# EAGLE design usb-led (EAGLE 6.6.0)
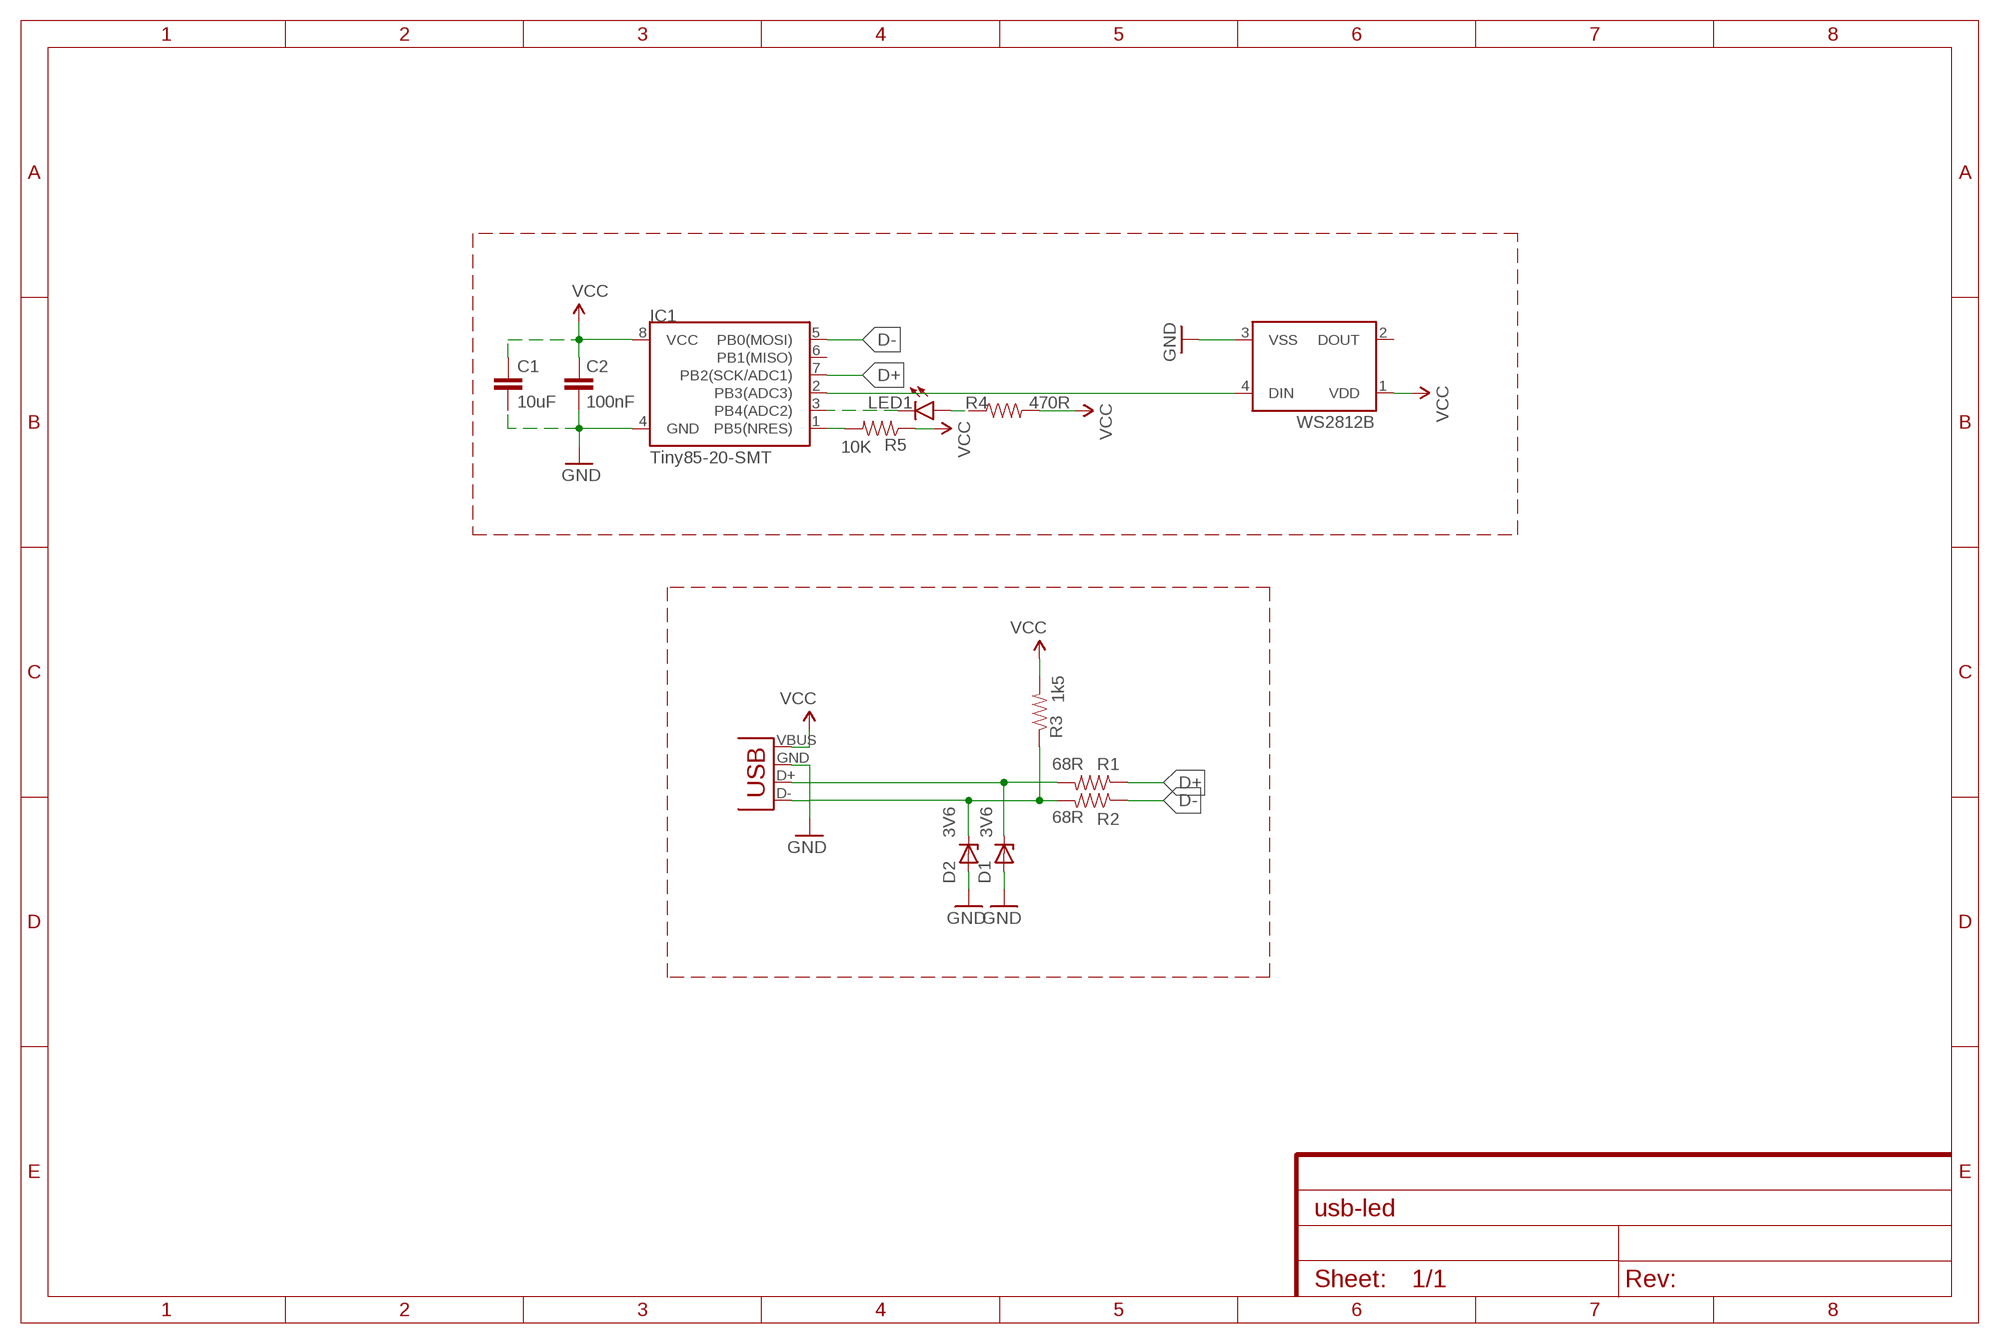
[diagram p0: schematic, sheet 1]

## Parts
C1  10uF  C-EUC0805  [C0805]
C2  100nF  CAP0805  [0805]
D1  3V6  ZD0603  [ZD0603]
D2  3V6  ZD0603  [ZD0603]
IC1  Tiny85-20-SMT  ATTINY45TINY85-20-SMT  [SO08-EIAJ]
LED1  LED0603  [LED-0603]
R1  68R  RESISTOR0603  [0603-RES]
R2  68R  RESISTOR0603  [0603-RES]
R3  1k5  RESISTOR0603  [0603-RES]
R4  470R  RESISTOR0603  [0603-RES]
R5  10K  RESISTOR0603-RES  [0603-RES]
USB  USB-A-H  [USB-A-H]
WS2812B  WS2812B  [WS2812B]

## Nets
C10: IC1.1(PB5(NRES)) R5.2
D+: IC1.7(PB2(SCK/ADC1)) R1.1
D-: IC1.5(PB0(MOSI)) R2.1
DIN: IC1.2(PB3(ADC3)) WS2812B.4(DIN)
EXT_D+: D1.K(C) R1.2 USB.D+(D-)
EXT_D-: D2.K(C) R2.2 R3.1 USB.D-(D+)
GND: C1.2 C2.2 D1.A D2.A IC1.4(GND) USB.GND(VBUS) WS2812B.3(VSS)
N$3: IC1.3(PB4(ADC2)) LED1.C
N$4: LED1.A R4.1
VCC: C1.1 C2.1 IC1.8(VCC) R3.2 R4.2 R5.1 USB.VBUS(GND) WS2812B.1(VDD)
Unconnected: IC1.6(PB1(MISO)) WS2812B.2(DOUT)

## Library data of the parts
C1 = rcl:C-EU: CAPACITOR, European symbol
C2 = SparkFun-Passives:CAP: Capacitor Standard 0603 ceramic capacitor, and 0.1" leaded capacitor.
D1 D2 = z-diode-0603:ZD0603: Z DIODE
IC1 = SparkFun-DigitalIC:ATTINY45: Atmel 8-pin 2/4/8kB flash uC; PROD_ID: IC-09092
LED1 = SparkFun-LED:LED: LEDs Standard schematic elements and footprints for 5mm, 3mm, 1206, and 0603 sized LEDs. 5mm - Spark Fun Electronics SKU : COM-00529 (and others)
R1-R5 = SparkFun-Resistors:RESISTOR: Resistor Basic schematic elements and footprints for 0603, 1206, and PTH resistors.
USB = SparkFun-Connectors:USB: USB Connectors USB-B-PTH is fully proven SKU : PRT-00139/CONN-08278 USB-miniB is fully proven SKU : PRT-00587 USB-A-PCB is untested. USB-A-H is throughly reviewed, but untested. Spark Fun Electronics SKU : PRT-00437 USB-B-SMT is throughly reviewed, but untested. Needs silkscreen touching up. USB-A-S has not been used/tested USB-MB-H has not been used/tested USB-MICROB has been used. CONN-09505
WS2812B = SparkFun-LED:WS2812B: WS2812B - Intelligent control LED integrated light source Technical Specifications: Power Supply Voltage (VDD): 3.5 to 5.3 V Input Voltage (VI): -0.5 to VDD+0.5 V Operating Junction Temperature (Topt): -25°C to +80°C Storage Temperature Range (Tstg): -55°C to +150°C

## Board
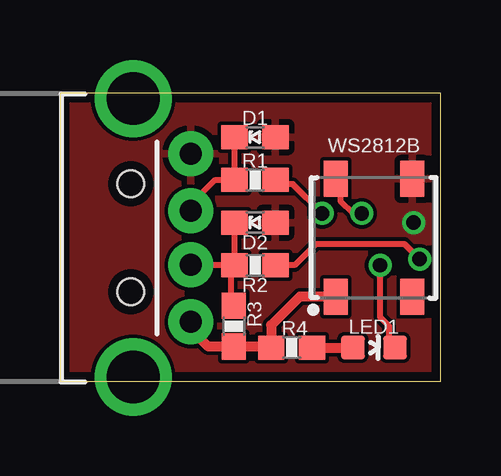
[diagram p1: board, top side]
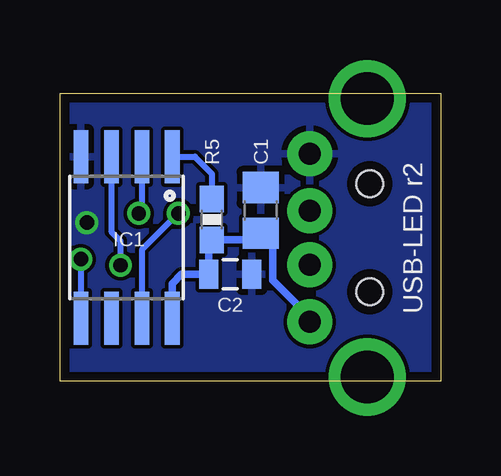
[diagram p2: board, bottom side, seen from below]

Size 15.85 x 11.99 mm. Coordinates in mm from the lower left corner, seen from the top.
Outline: 0,0 15.85,0 15.85,11.99 0,11.99 0,0
Copper layers (1*16): Top 0.0356mm / dielectric 1.5011mm / Bottom 0.0356mm
Design rules "LaenPCBOrder *": minimum track width 8mil, minimum drill 13mil, track to track 6mil, track to pad 6mil, pad to pad 6mil, via to via 6mil, smd to smd 6mil, copper to edge 15mil, drill to drill 6mil, minimum pad ring 7mil, minimum via ring 7mil, stop-mask expansion 3mil, vias tented up to drill 0mil, thermal gap 10mil
bKeepout: area 8.6,8.3 to 10.7,11.8; area 8.8,0.1 to 10.8,3.7

### Footprints (pad centres in the part's own frame; a part is rotated, then mirrored left to right if it is on the bottom)
C0805 = smd 1.3 x 1.5: 1 -0.95,0; 2 0.95,0
0805 = smd 0.8 x 1.2: 1 -0.9,0; 2 0.9,0
ZD0603 = smd 1.1 x 1: A -0.85,0; K 0.85,0
SO08-EIAJ = smd 0.61 x 2.21: 1 -1.905,-3.378; 2 -0.635,-3.378; 3 0.635,-3.378; 4 1.905,-3.378; 5 1.905,3.353; 6 0.635,3.353; 7 -0.635,3.353; 8 -1.905,3.353
LED-0603 = smd 1 x 1: A 0,-0.877; C 0,0.877
0603-RES = smd 1.1 x 1: 1 -0.85,0; 2 0.85,0
USB-A-H = drill 0.914 pad 1.88: D+ 2.4,1.127; D- 2.4,-1.127; GND 2.4,3.5; VBUS 2.4,-3.5 | drill 2.2: GND2 0,-5.8; GND3 0,5.8 | hole 1.1: -0.1,2.25; -0.1,-2.25
WS2812B = smd 1.5 x 1: 1 -2.45,1.6; 2 -2.45,-1.6; 3 2.45,-1.6; 4 2.45,1.6

### Placement (x,y rotation side)
C1  7.49,7.11 90 bottom
C2  8.76,4.45 0 bottom
D1  8.13,10.16 180 top
D2  8.13,6.6 180 top
IC1  13.08,5.97 180 bottom
LED1  13.08,1.4 270 top
R1  8.13,8.38 180 top
R2  8.13,4.83 180 top
R3  7.24,2.29 270 top
R4  9.65,1.4 180 top
R5  9.52,6.73 90 bottom
USB  3.05,5.97 0 top
WS2812B  13.08,5.97 90 top

### Tracks (layer width: path | path; a pad name or v marks a point on that pad's centre or on a via)
C10
  Bottom 0.254: IC1.1 10.24,9.35 9.52,8.64 R5.2
D+  (via drill 0.6)
  Top 0.254: v10.92,6.98 9.7,8.2 9.16,8.2 R1.1
  Bottom 0.254: v10.92,6.98 12.45,5.46 IC1.7
D-  (via drill 0.6)
  Top 0.254: v14.99,5.08 14.35,5.71 10.67,5.71 9.78,4.83 R2.1
  Bottom 0.254: v14.99,5.08 IC1.5
DIN  (via drill 0.6)
  Top 0.254: WS2812B.4 11.68,8.22 11.68,7.49 12.19,6.98 v12.57,6.98
  Top 0.305: WS2812B.4 11.43,8.47
  Bottom 0.254: IC1.2 12.45,7.11 v12.57,6.98
EXT_D+
  Top 0.254: D1.K R1.2 6.48,8.38 5.45,7.35 USB.D+
EXT_D-
  Top 0.254: R2.2 5.46,4.83 USB.D- | R2.2 7.11,4.79 7.11,3.26 R3.1 | R2.2 D2.K
GND  (via drill 0.6)
  other vias: 14.73,6.6
  pour Bottom: 0.13,0.13 15.75,0.13 15.75,11.81 0.13,11.81
  pour Top: 0.13,0.13 15.75,0.13 15.75,11.81 0.13,11.81
N$3  (via drill 0.6)
  Top 0.254: LED1.C 13.72,1.51 13.72,2.29 13.34,2.67 v13.34,4.83
  Bottom 0.254: IC1.3 13.72,6.22 13.34,5.84 v13.34,4.83
N$4
  Top 0.406: R4.1 10.63,1.27 10.76,1.4 LED1.A
VCC
  Top 0.254: R4.2 8.64,1.44
  Top 0.406: 11.56,3.44 WS2812B.1 10,3.52 8.8,2.32 R4.2 | 8.64,1.44 R3.2 6.18,1.44 5.45,2.17 USB.VBUS
  Bottom 0.254: IC1.8 11.11,2.55 | 7.65,5.88 C1.1 | C1.1 7.09,5.86 | 7.09,5.86 6.98,5.78 | 9.66,5.74 R5.1 | 7.77,5.88 C1.1 | 7.09,5.86 6.98,5.86
  Bottom 0.305: 9.66,5.74 C2.1 10.8,4.45 11.18,4.06 IC1.8 | R5.1 7.77,5.88 | 6.98,5.86 6.98,4.19 5.45,2.65 USB.VBUS

### Text on the board
bNames: USB-LED r2